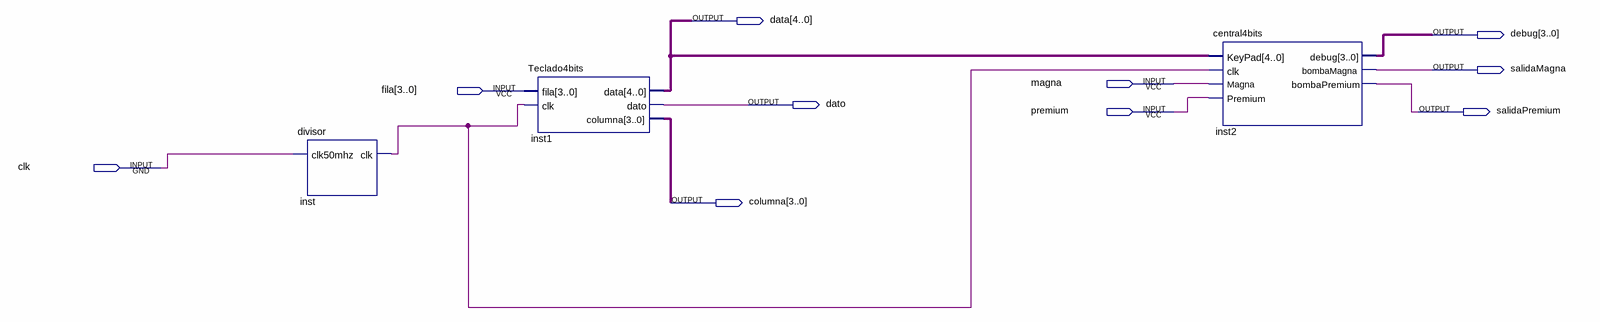
[diagram p0: schematic sheet]
// Quartus schematic DDM.bdf as structural Verilog: 3 symbols, 10 pins
module DDM (
  input  magna,
  input  [3:0] fila,
  input  premium,
  input  clk,
  output [4:0] data,
  output [3:0] debug,
  output salidaMagna,
  output dato,
  output salidaPremium,
  output [3:0] columna
);

  wire inst_clk;

  divisor inst (.clk50mhz(clk), .clk(inst_clk));
  Teclado4bits inst1 (.fila(fila), .clk(inst_clk), .data(data), .dato(dato), .columna(columna));
  central4bits inst2 (
    .KeyPad(data), .clk(inst_clk), .Magna(magna), .Premium(premium), .debug(debug), .bombaMagna(salidaMagna),
    .bombaPremium(salidaPremium));
endmodule
